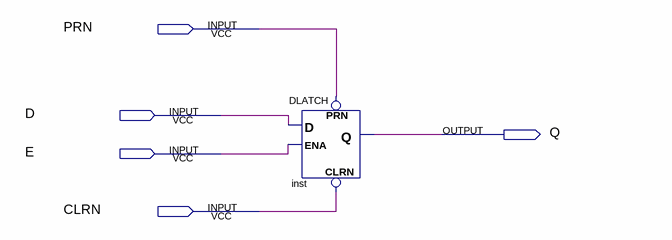
[diagram p0: schematic sheet]
// Quartus schematic Akram_10_3_2021_DLatch.bdf as structural Verilog: 1 symbols, 5 pins
module Akram_10_3_2021_DLatch (
  input  PRN,
  input  D,
  input  E,
  input  CLRN,
  output Q
);

  DLATCH inst (.CLRN(CLRN), .D(D), .ENA(E), .PRN(PRN), .Q(Q));
endmodule
